# Altium schematic sheet openrex_addon_V1.SchDoc
size A
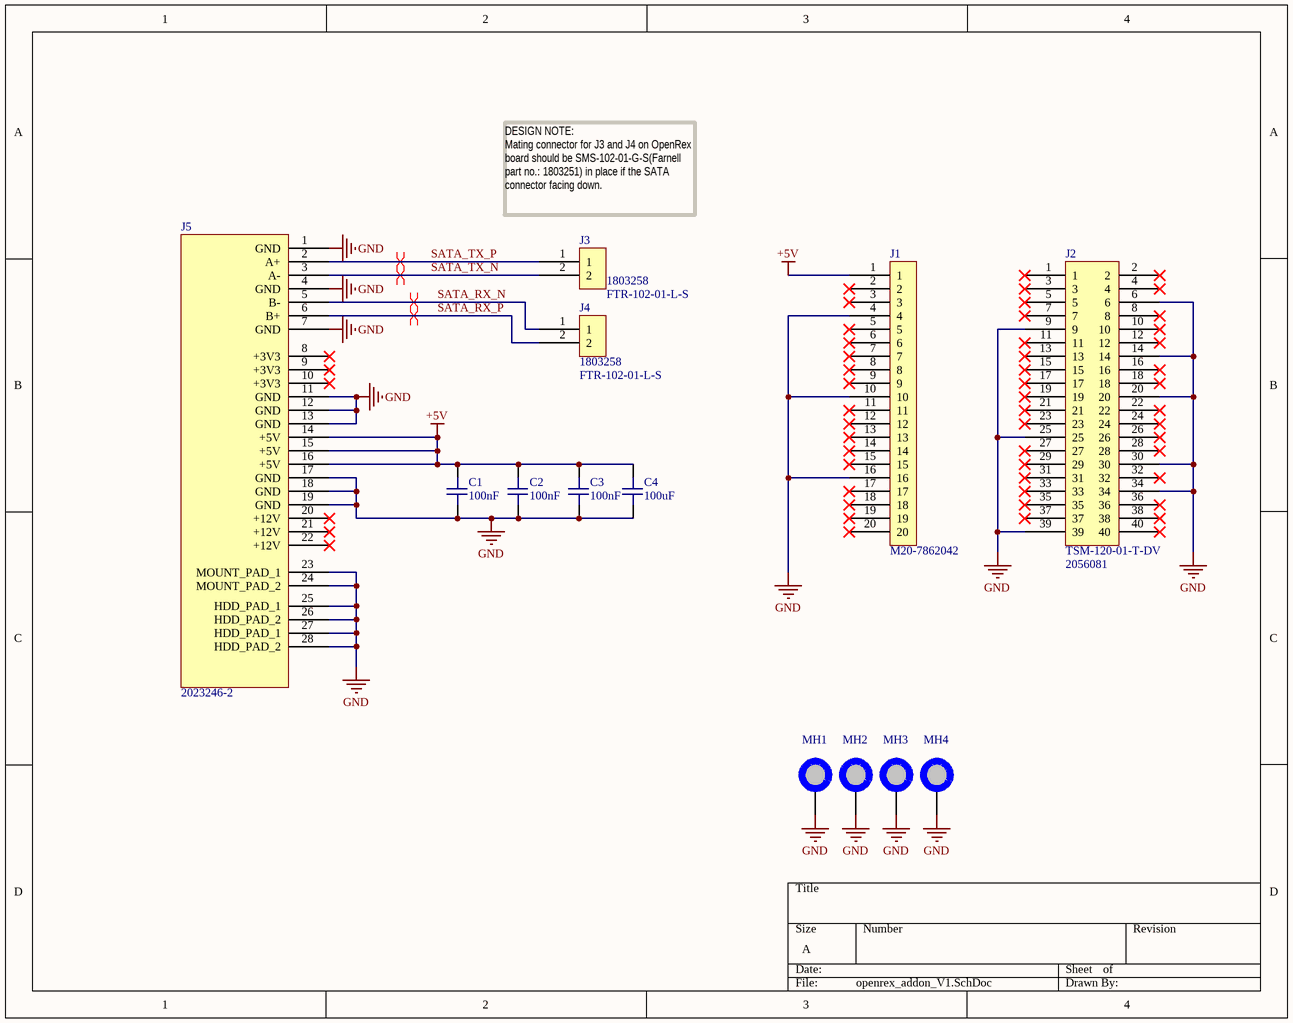
[diagram p0: openrex_addon_V1.SchDoc]

## Parts
C1  100nF  [C0805]
C2  100nF  [C0805]
C3  100nF  [C0805]
C4  100uF  [C1206]
J1  M20-7862042  [20x1 2.54 Female SMD]
J2  TSM-120-01-T-DV  Supplier Part Number 2: 2056081  [20x2 2.54 Male SMD]
J3  FTR-102-01-L-S  Supplier Part Number 2: 1803258  [SATA_SIGNAL]
J4  FTR-102-01-L-S  Supplier Part Number 2: 1803258  [SATA_SIGNAL]
J5  2023246-2  [SATA]
MH1  MH_7.4MMC_3.2MMD  [MH_7.4MMD_3.2MMD]  (value not drawn)  (no BOM)
MH2  MH_7.4MMC_3.2MMD  [MH_7.4MMD_3.2MMD]  (value not drawn)  (no BOM)
MH3  MH_7.4MMC_3.2MMD  [MH_7.4MMD_3.2MMD]  (value not drawn)  (no BOM)
MH4  MH_7.4MMC_3.2MMD  [MH_7.4MMD_3.2MMD]  (value not drawn)  (no BOM)

## Nets
+5V: C1.2 C2.2 C3.2 C4.2 J1.1 J5.14(+5V) J5.15(+5V) J5.16(+5V)
GND: C1.1 C2.1 C3.1 C4.1 J1.4 J1.10 J1.16 J2.6 J2.9 J2.14 J2.20 J2.25 J2.30 J2.34 J2.39 J5.1(GND) J5.4(GND) J5.7(GND) J5.11(GND) J5.12(GND) J5.13(GND) J5.17(GND) J5.18(GND) J5.19(GND) J5.23(MOUNT_PAD_1) J5.24(MOUNT_PAD_2) J5.25(HDD_PAD_1) J5.26(HDD_PAD_2) J5.27(HDD_PAD_1) J5.28(HDD_PAD_2) MH1.1 MH2.1 MH3.1 MH4.1
SATA_RX_N: J4.1 J5.5(B-)
SATA_RX_P: J4.2 J5.6(B+)
SATA_TX_N: J3.2 J5.3(A-)
SATA_TX_P: J3.1 J5.2(A+)

Not connected (* = marked no-connect by the designer): J1 2* 3* 5* 6* 7* 8* 9* 11* 12* 13* 14* 15* 17* 18* 19* 20*; J2 1* 2* 3* 4* 5* 7* 8* 10* 11* 12* 13* 15* 16* 17* 18* 19* 21* 22* 23* 24* 26* 27* 28* 29* 31* 32* 33* 35* 36* 37* 38* 40*; J5 8(+3V3)* 9(+3V3)* 10(+3V3)* 20(+12V)* 21(+12V)* 22(+12V)*

## Layout directives
differential pair: SATA_RX_N, SATA_RX_P, SATA_TX_N, SATA_TX_P

## Notes on the sheet
- (near J3) DESIGN NOTE:
  Mating connector for J3 and J4 on OpenRex board should be SMS-102-01-G-S(Farnell part no.: 1803251) in place if the SATA connector facing down.

## Library data of the parts
C1-C3 = C2012X7R1H104K085AA: CAP CER 0.1UF 50V X7R 0805; Manufacturer: TDK Corporation; Capacitance: 0.1µF; Tolerance: ±10%; Supplier 1: Digi-Key; Manufacturer Part Number: C2012X7R1H104K085AA; RoHS: RoHS Compliant; Category: Capacitors; Stock 1: 788153; Pricing 1: 1=0.11, 10=0.078, 25=0.0572, 50=0.0444, 100=0.0368, 250=0.03044, 500=0.02578, 1000=0.02134 (USD); Packaging: Cut Tape (CT); Part Status: Not For New Designs; Voltage - Rated: 50V; Temperature Coefficient: X7R; Operating Temperature: -55°C ~ 125°C; Features: Low ESL; Ratings: -; Applications: General Purpose; Failure Rate: -; Mounting Type: Surface Mount, MLCC; Package / Case: 0805 (2012 Metric); Size / Dimension: 0.079" L x 0.049" W (2.00mm x 1.25mm); Height - Seated (Max): -; Thickness (Max): 0.037" (0.95mm); Lead Spacing: -; Lead Style: -; ComponentLink1URL: https://product.tdk.com/info/en/catalog/datasheets/mlcc_commercial_general_en.pdf; ComponentLink1Description: https://product.tdk.com/info/en/catalog/datasheets/mlcc_commercial_general_en.pdf; Supplier Part Number 1: 445-7534-1-ND
C4 = C3216X5R1A107M160AC: CAP CER 100UF 10V X5R 1206; Manufacturer: TDK Corporation; Tolerance: ±20%; Supplier 1: Digi-Key; Manufacturer Part Number: C3216X5R1A107M160AC; RoHS: RoHS Compliant; Category: Capacitors; Stock 1: 153116; Pricing 1: 1=1.59, 10=1.252, 100=0.9393, 500=0.70966, 1000=0.62618 (USD); Packaging: Cut Tape (CT); Part Status: Active; Voltage - Rated: 10V; Temperature Coefficient: X5R; Operating Temperature: -55°C ~ 85°C; Features: Low ESL; Ratings: -; Applications: General Purpose; Failure Rate: -; Mounting Type: Surface Mount, MLCC; Package / Case: 1206 (3216 Metric); Size / Dimension: 0.126" L x 0.063" W (3.20mm x 1.60mm); Height - Seated (Max): -; Thickness (Max): 0.075" (1.90mm); Lead Spacing: -; Lead Style: -; ComponentLink1URL: https://product.tdk.com/info/en/catalog/datasheets/mlcc_commercial_general_en.pdf; ComponentLink1Description: https://product.tdk.com/info/en/catalog/datasheets/mlcc_commercial_general_en.pdf; Supplier Part Number 1: 445-6007-1-ND
J1 = M20-7862042: HARWIN - M20-7862042 - SOCKET, BOTTOM ENTRY, SMT, 20WAY; Pitch Spacing: 2.54; No. of Contacts: 20; Gender: Receptacle; Product Range: M20 Series; Contact Termination Type: Surface Mount; No. of Rows: 1; SVHC: No SVHC (12-Jan-2017); Contact Termination: Surface Mount Vertical; Current Rating: 3; External Length / Height: 7.1; Insulation Resistance: 1000; Proof Voltage: 600; Voltage Rating V AC: 500; Withstand Voltage: 1000V<!--FANDB--><div class="features-and-benefits-container"><div class="features-and-benefits-description"><span class="features-benefits-value">The M20-7862042 is a 20-contact 2.54mm female SIL Board-to-board Socket with gold plated phosphor bronze contacts, 100% tin over nickel plated termination and black UL94V-0 polyamide (nylon) 6T housing. The M20 series receptacle has vertical connector orientation, surface mount (SMT) connection type and dual entry style (bottom entry, top entry). It is suitable for use with 0.64mm square mating pin size. Suitable for interconnecting board to board. The socket is a box section design with a latch to locate and hold in an insulated housing.</span></div><div class="features-and-benefits-list"><ul class="features-and-benefits-list-list"><li class="features-and-benefits-list-item">3A Current rating</li><li class="features-and-benefits-list-item">20; Supplier 1: Farnell; Manufacturer: HARWIN; Manufacturer Part Number: M20-7862042; RoHS: YES; Stock 1: 2217; Pricing 1: 1=1.1, 25=1.09, 50=1.07, 100=1.06, 250=0.946, 500=0.753, 2000=0.703, 5000=0.667 (GBP); Contact Plating: Gold Plated Contacts; Contact Material: Phosphor Bronze; Colour: Black; Contact Resistance: 20; Flammability Rating: UL94V-0; Lead Spacing: 4.2; Length: 51.05; Material: Nylon 6; Operating Temperature Max: +105; Operating Temperature Min: -40; Termination Method: Solder; ComponentLink1URL: http://www.farnell.com/datasheets/1089497.pdf; ComponentLink1Description: http://www.farnell.com/datasheets/1089497.pdf; ComponentLink2URL: http://www.farnell.com/datasheets/1836954.pdf; ComponentLink2Description: http://www.farnell.com/datasheets/1836954.pdf; Supplier Part Number 1: 1256661
J2 = TSM-120-01-T-DV: CONN HEADER 40POS .100" DBL SMD; Manufacturer: Samtec Inc.; Pitch - Mating: 0.100" (2.54mm); Style: Board to Board or Cable; Shrouding: Unshrouded; Number of Positions: 40; Number of Positions Loaded: All; Contact Length - Mating: 0.230" (5.84mm); Material Flammability Rating: UL94 V-0; Supplier 1: Digi-Key; Manufacturer Part Number: TSM-120-01-T-DV; RoHS: RoHS Compliant; Category: Connectors, Interconnects; Stock 1: 499; Pricing 1: 1=2.65, 10=2.544, 100=2.12, 500=1.802, 1000=1.537, 5000=1.378 (USD); Packaging: Tube; Part Status: Active; Connector Type: Header; Contact Type: Male Pin; Number of Rows: 2; Row Spacing - Mating: 0.100" (2.54mm); Mounting Type: Surface Mount; Termination: Solder; Fastening Type: -; Contact Length - Post: -; Overall Contact Length: -; Insulation Height: 0.100" (2.54mm); Contact Shape: Square; Contact Finish - Mating: Tin; Contact Finish Thickness - Mating: -; Contact Finish - Post: Tin; Contact Material: Phosphor Bronze; Insulation Material: Liquid Crystal Polymer (LCP); Features: -; Operating Temperature: -55°C ~ 105°C; Ingress Protection: -; Insulation Color: Black; Current Rating: -; Voltage Rating: -; Mated Stacking Heights: -; Contact Finish Thickness - Post: -; Applications: -; ComponentLink1URL: http://suddendocs.samtec.com/prints/tsm-1xx-xx-xxx-xx-x-xxx-x-mkt.pdf; ComponentLink1Description: http://suddendocs.samtec.com/prints/tsm-1xx-xx-xxx-xx-x-xxx-x-mkt.pdf; Supplier Part Number 1: SAM10823-ND; Supplier 2: Farnell
J3 J4 = FTR-102-01-L-S: SMT .050'' STRIPS; Manufacturer: Samtec Inc.; Connector Type: Header; Pitch - Mating: 0.050" (1.27mm); Style: Board to Board; Shrouding: Unshrouded; Number of Positions: 2; Number of Positions Loaded: All; Contact Length - Mating: 0.230" (5.84mm); Material Flammability Rating: UL94 V-0; Current Rating: 3.1A per Contact; Supplier 1: Digi-Key; Manufacturer Part Number: FTR-102-01-L-S; RoHS: RoHS Compliant; Category: Connectors, Interconnects; Stock 1: 0; Pricing 1: 1=0.44 (USD); Packaging: Tube; Part Status: Active; Contact Type: Male Pin; Number of Rows: 1; Row Spacing - Mating: -; Mounting Type: Surface Mount; Termination: Solder; Fastening Type: -; Contact Length - Post: -; Overall Contact Length: -; Insulation Height: 0.100" (2.54mm); Contact Shape: Square; Contact Finish - Mating: Gold; Contact Finish Thickness - Mating: 10µin (0.25µm); Contact Finish - Post: Tin; Contact Material: Phosphor Bronze; Insulation Material: Liquid Crystal Polymer (LCP); Features: -; Operating Temperature: -55°C ~ 125°C; Ingress Protection: -; Insulation Color: Black; Voltage Rating: -; Mated Stacking Heights: -; Contact Finish Thickness - Post: -; Applications: -; Supplier Part Number 1: FTR-102-01-L-S-ND; Supplier 2: Farnell
J5 = 2023246-2: CONN RECEPT SATA 22POS R/A SMD; Manufacturer: TE Connectivity AMP Connectors; Connector Style: Receptacle; Number of Positions: 22; Supplier 1: Digi-Key; Manufacturer Part Number: 2023246-2; RoHS: RoHS Compliant; Category: Connectors, Interconnects; Stock 1: 695; Pricing 1: 1=2.64, 10=2.536, 50=2.2186, 100=2.113, 250=1.84884, 500=1.79602, 1000=1.5319, 2500=1.42625 (USD); Packaging: Tray; Part Status: Active; Connector Type: SATA; Mounting Type: Surface Mount, Right Angle; Termination: Solder; Features: Board Guide; Contact Finish: Gold; Contact Finish Thickness: 30µin (0.76µm); ComponentLink1URL: http://www.te.com/commerce/DocumentDelivery/DDEController?Action=srchrtrv&DocNm=2023246&DocType=Customer+Drawing&DocLang=English; ComponentLink1Description: http://www.te.com/commerce/DocumentDelivery/DDEController?Action=srchrtrv&DocNm=2023246&DocType=Customer+Drawing&DocLang=English; Supplier Part Number 1: A119693-ND
MH1-MH4 = MH_7.4MMC_3.2MMD: Mounting hole 7.4mm Diameter, 3.2 Drill